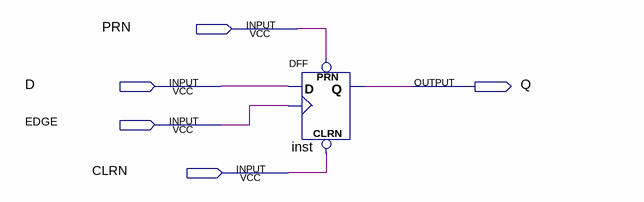
[diagram p0: schematic sheet]
// Quartus schematic Emdad_03_14_2022_d_flip_flop_component_VHDL.bdf as structural Verilog: 1 symbols, 5 pins
module Emdad_03_14_2022_d_flip_flop_component_VHDL (
  input  PRN,
  input  D,
  input  EDGE,
  input  CLRN,
  output Q
);

  DFF inst (.CLRN(CLRN), .CLK(EDGE), .D(D), .PRN(PRN), .Q(Q));
endmodule
